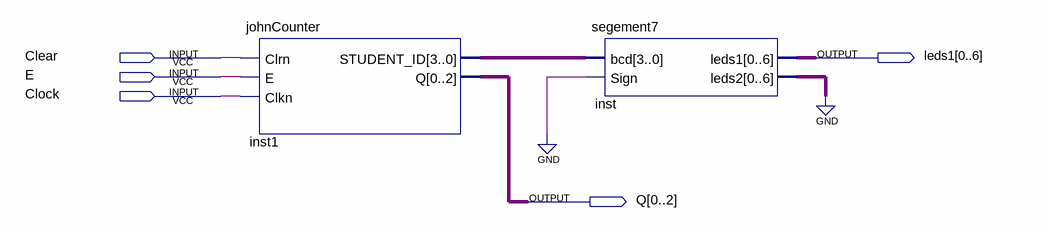
[diagram p0: schematic sheet]
// Quartus schematic johnC.bdf as structural Verilog: 2 symbols, 5 pins
module johnC (
  input  Clear,
  input  E,
  input  Clock,
  output [0:6] leds1,
  output [0:2] Q
);

  wire [3:0] inst1_student_id;
  wire [6:0] inst_leds2;

  johnCounter inst1 (.Clrn(Clear), .E(E), .Clkn(Clock), .STUDENT_ID(inst1_student_id), .Q(Q));
  segement7 inst (.bcd(inst1_student_id), .Sign(1'b0), .leds1(leds1), .leds2(inst_leds2));
  // also tied to GND on the sheet: {inst_leds2[0], inst_leds2[1], inst_leds2[2], inst_leds2[3], inst_leds2[4], inst_leds2[5], inst_leds2[6]}
endmodule
